# Altium schematic sheet 4_CPU.SchDoc
size A3
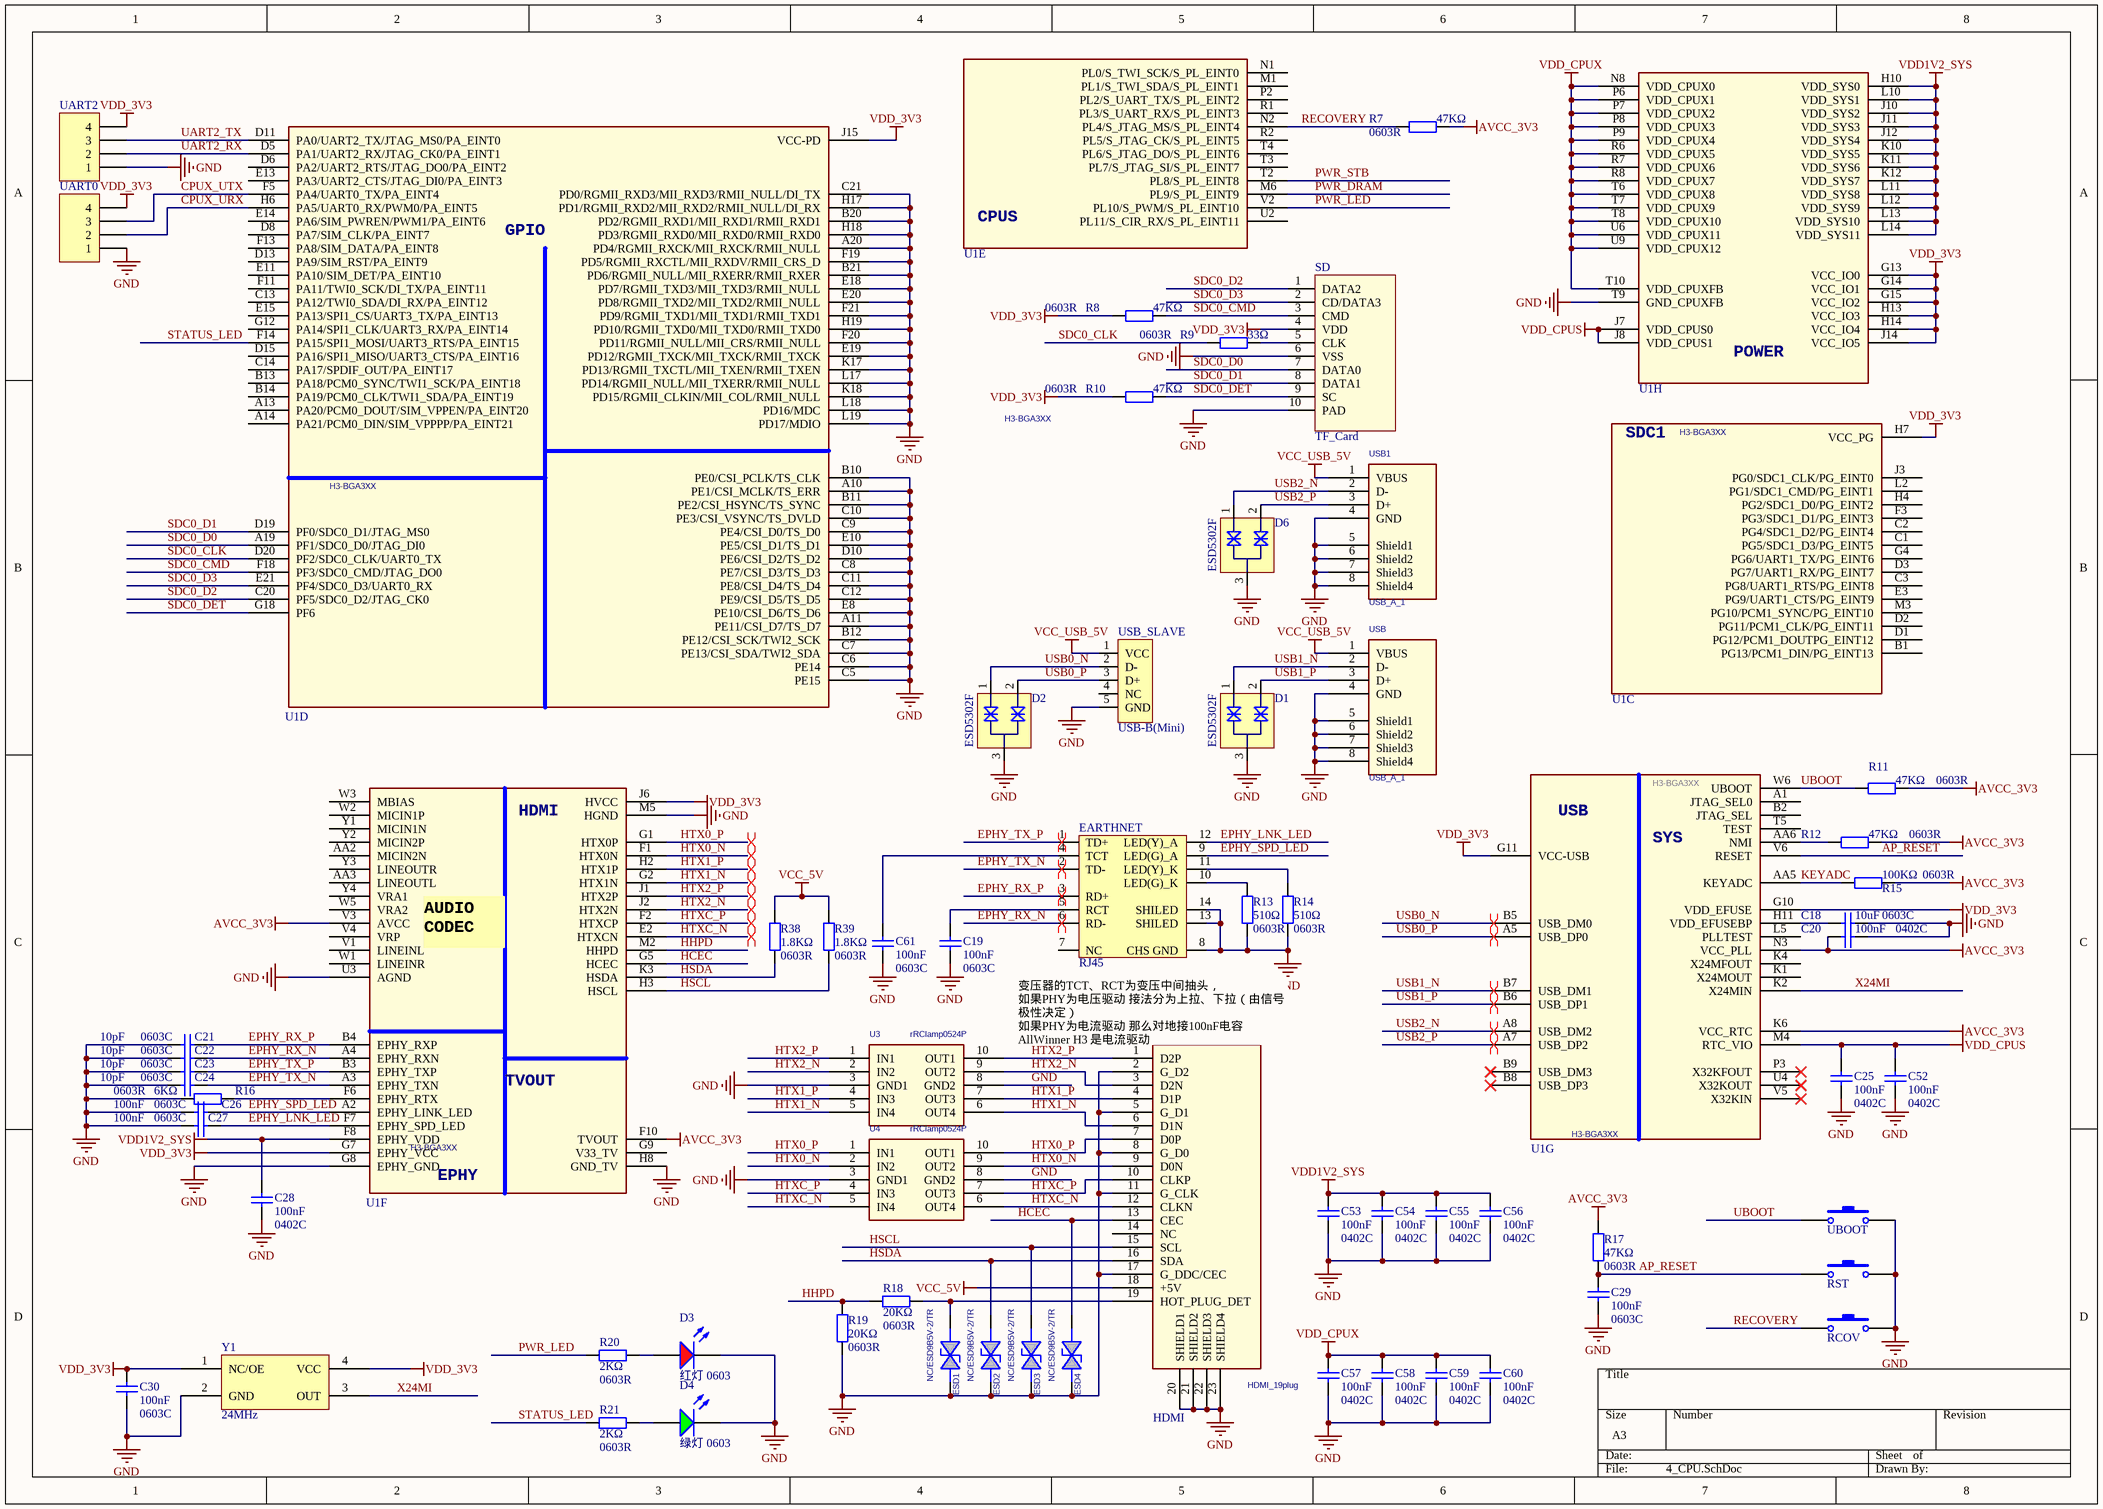
[diagram p0: 4_CPU.SchDoc]

## Parts
C18  10uF  Package: 0603C  [0603_C]
C19  100nF  Package: 0603C  [0603_C]
C20  100nF  Package: 0402C  [0402_C]
C21  10pF  Package: 0603C  [0603_C]
C22  10pF  Package: 0603C  [0603_C]
C23  10pF  Package: 0603C  [0603_C]
C24  10pF  Package: 0603C  [0603_C]
C25  100nF  Package: 0402C  [0402_C]
C26  100nF  Package: 0603C  [0603_C]
C27  100nF  Package: 0603C  [0603_C]
C28  100nF  Package: 0402C  [0402_C]
C29  100nF  Package: 0603C  [0603_C]
C30  100nF  Package: 0603C  [0603_C]
C52  100nF  Package: 0402C  [0402_C]
C53  100nF  Package: 0402C  [0402_C]
C54  100nF  Package: 0402C  [0402_C]
C55  100nF  Package: 0402C  [0402_C]
C56  100nF  Package: 0402C  [0402_C]
C57  100nF  Package: 0402C  [0402_C]
C58  100nF  Package: 0402C  [0402_C]
C59  100nF  Package: 0402C  [0402_C]
C60  100nF  Package: 0402C  [0402_C]
C61  100nF  Package: 0603C  [0603_C]
D1  ESD5302F  [SOT23-3]
D2  ESD5302F  [SOT23-3]
D3  红灯 0603  [0603_LED_S1]
D4  绿灯 0603  [0603_LED_S1]
D6  ESD5302F  [SOT23-3]
EARTHNET  RJ45  [HR911105A]
ESD1  NC/ESD9B5V-2/TR  [tvs0402]
ESD2  NC/ESD9B5V-2/TR  [tvs0402]
ESD3  NC/ESD9B5V-2/TR  [tvs0402]
ESD4  NC/ESD9B5V-2/TR  [tvs0402]
HDMI  HDMI_19plug  [HDMI_SMD_A]
R7  47KΩ  Package: 0603R  [0603_R]
R8  47KΩ  Package: 0603R  [0603_R]
R9  33Ω  Package: 0603R  [0603_R]
R10  47KΩ  Package: 0603R  [0603_R]
R11  47KΩ  Package: 0603R  [0603_R]
R12  47KΩ  Package: 0603R  [0603_R]
R13  510Ω  Package: 0603R  [0603_R]
R14  510Ω  Package: 0603R  [0603_R]
R15  100KΩ  Package: 0603R  [0603_R]
R16  6KΩ  Package: 0603R  [0603_R]
R17  47KΩ  Package: 0603R  [0603_R]
R18  20KΩ  Package: 0603R  [0603_R]
R19  20KΩ  Package: 0603R  [0603_R]
R20  2KΩ  Package: 0603R  [0603_R]
R21  2KΩ  Package: 0603R  [0603_R]
R38  1.8KΩ  Package: 0603R  [0603_R]
R39  1.8KΩ  Package: 0603R  [0603_R]
RCOV  SW-PB  [SW_PB2_A1]  (value not drawn)
RST  SW-PB  [SW_PB2_A1]  (value not drawn)
SD  TF_Card  [SD_MINI]
U1  H3-BGA3XX  [BGA347P0_65B14X14]  (parts C,D,E,F,G,H of 9)
U3  rRClamp0524P  [RCLAMP0524P]
U4  rRClamp0524P  [RCLAMP0524P]
UART0  SWD  [HDR1X4]  (value not drawn)
UART2  SWD  [HDR1X4]  (value not drawn)
UBOOT  SW-PB  [SW_PB2_A1]  (value not drawn)
USB  USB_A_1  [USB_A_1]
USB1  USB_A_1  [USB_A_1]
USB_SLAVE  USB-B(Mini)  [USB/SM0.8-6H5]
Y1  24MHz  [SMDXTAL3225]

## Nets
AVCC_3V3: C20.2 R7.1 R11.1 R12.1 R15.1 R17.1 U1.F10(TVOUT) U1.K6(VCC_RTC) U1.N3(VCC_PLL) U1.V3(AVCC)
GND: C18.2 C19.1 C20.1 C21.2 C22.2 C23.2 C24.2 C25.1 C26.2 C27.2 C28.1 C29.1 C30.1 C52.1 C53.1 C54.1 C55.1 C56.1 C57.1 C58.1 C59.1 C60.1 C61.1 D1.3 D2.3 D3.K D4.K D6.3 EARTHNET.8(CHS_GND) EARTHNET.13(SHILED) EARTHNET.14(SHILED) ESD1.2(CATHODE) ESD2.2(CATHODE) ESD3.2(CATHODE) ESD4.2(CATHODE) HDMI.2(G_D2) HDMI.5(G_D1) HDMI.8(G_D0) HDMI.11(G_CLK) HDMI.17(G_DDC/CEC) HDMI.20(SHIELD1) HDMI.21(SHIELD2) HDMI.22(SHIELD3) HDMI.23(SHIELD4) R13.2 R14.2 R16.2 R19.1 RCOV.2 RST.2 SD.6(VSS) SD.10(PAD) U1.A10(PE1/CSI_MCLK/TS_ERR) U1.A11(PE11/CSI_D7/TS_D7) U1.A20(PD4/RGMII_RXCK/MII_RXCK/RMII_NULL) U1.B10(PE0/CSI_PCLK/TS_CLK) U1.B11(PE2/CSI_HSYNC/TS_SYNC) U1.B12(PE12/CSI_SCK/TWI2_SCK) U1.B20(PD2/RGMII_RXD1/MII_RXD1/RMII_RXD1) U1.B21(PD6/RGMII_NULL/MII_RXERR/RMII_RXER) U1.C5(PE15) U1.C6(PE14) U1.C7(PE13/CSI_SDA/TWI2_SDA) U1.C8(PE7/CSI_D3/TS_D3) U1.C9(PE4/CSI_D0/TS_D0) U1.C10(PE3/CSI_VSYNC/TS_DVLD) U1.C11(PE8/CSI_D4/TS_D4) U1.C12(PE9/CSI_D5/TS_D5) U1.C21(PD0/RGMII_RXD3/MII_RXD3/RMII_NULL/DI_TX) U1.D10(PE6/CSI_D2/TS_D2) U1.E8(PE10/CSI_D6/TS_D6) U1.E10(PE5/CSI_D1/TS_D1) U1.E18(PD7/RGMII_TXD3/MII_TXD3/RMII_NULL) U1.E19(PD12/RGMII_TXCK/MII_TXCK/RMII_TXCK) U1.E20(PD8/RGMII_TXD2/MII_TXD2/RMII_NULL) U1.F19(PD5/RGMII_RXCTL/MII_RXDV/RMII_CRS_D) U1.F20(PD11/RGMII_NULL/MII_CRS/RMII_NULL) U1.F21(PD9/RGMII_TXD1/MII_TXD1/RMII_TXD1) U1.G8(EPHY_GND) U1.H8(GND_TV) U1.H17(PD1/RGMII_RXD2/MII_RXD2/RMII_NULL/DI_RX) U1.H18(PD3/RGMII_RXD0/MII_RXD0/RMII_RXD0) U1.H19(PD10/RGMII_TXD0/MII_TXD0/RMII_TXD0) U1.K17(PD13/RGMII_TXCTL/MII_TXEN/RMII_TXEN) U1.K18(PD15/RGMII_CLKIN/MII_COL/RMII_NULL) U1.L17(PD14/RGMII_NULL/MII_TXERR/RMII_NULL) U1.L18(PD16/MDC) U1.L19(PD17/MDIO) U1.M5(HGND) U1.T9(GND_CPUXFB) U1.U3(AGND) U3.3(GND1) U3.8(GND2) U4.3(GND1) U4.8(GND2) UART0.1 UART2.1 UBOOT.2 USB.4(GND) USB.5(Shield1) USB.6(Shield2) USB.7(Shield3) USB.8(Shield4) USB1.4(GND) USB1.5(Shield1) USB1.6(Shield2) USB1.7(Shield3) USB1.8(Shield4) USB_SLAVE.5(GND) Y1.2(GND)
VCC_5V: HDMI.18(+5V) R38.1 R39.1
VCC_USB_5V: USB.1(VBUS) USB1.1(VBUS) USB_SLAVE.1(VCC)
VDD1V2_SYS: C28.2 C53.2 C54.2 C55.2 C56.2 U1.F8(EPHY_VDD) U1.H10(VDD_SYS0) U1.J10(VDD_SYS2) U1.J11(VDD_SYS3) U1.J12(VDD_SYS4) U1.K10(VDD_SYS5) U1.K11(VDD_SYS6) U1.K12(VDD_SYS7) U1.L10(VDD_SYS1) U1.L11(VDD_SYS8) U1.L12(VDD_SYS9) U1.L13(VDD_SYS10) U1.L14(VDD_SYS11)
VDD_3V3: C30.2 R8.2 R10.2 SD.4(VDD) U1.G7(EPHY_VCC) U1.G10(VDD_EFUSE) U1.G11(VCC-USB) U1.G13(VCC_IO0) U1.G14(VCC_IO1) U1.G15(VCC_IO2) U1.H7(VCC_PG) U1.H13(VCC_IO3) U1.H14(VCC_IO4) U1.J6(HVCC) U1.J14(VCC_IO5) U1.J15(VCC-PD) UART0.4 UART2.4 Y1.1(NC/OE) Y1.4(VCC)
VDD_CPUS: C25.2 C52.2 U1.J7(VDD_CPUS0) U1.J8(VDD_CPUS1) U1.M4(RTC_VIO)
VDD_CPUX: C57.2 C58.2 C59.2 C60.2 U1.N8(VDD_CPUX0) U1.P6(VDD_CPUX1) U1.P7(VDD_CPUX2) U1.P8(VDD_CPUX3) U1.P9(VDD_CPUX4) U1.R6(VDD_CPUX5) U1.R7(VDD_CPUX6) U1.R8(VDD_CPUX7) U1.T6(VDD_CPUX8) U1.T7(VDD_CPUX9) U1.T8(VDD_CPUX10) U1.T10(VDD_CPUXFB) U1.U6(VDD_CPUX11) U1.U9(VDD_CPUX12)
AP_RESET: C29.2 R17.2 RST.1 U1.V6(RESET)
CPUX_URX: U1.H6(PA5/UART0_RX/PWM0/PA_EINT5) UART0.2
CPUX_UTX: U1.F5(PA4/UART0_TX/PA_EINT4) UART0.3
EPHY_LNK_LED: C27.1 EARTHNET.12(LED(Y)_A) U1.F7(EPHY_SPD_LED)
EPHY_RX_N: C22.1 EARTHNET.6(RD-) U1.A4(EPHY_RXN)
EPHY_RX_P: C21.1 EARTHNET.3(RD+) U1.B4(EPHY_RXP)
EPHY_SPD_LED: C26.1 EARTHNET.9(LED(G)_A) U1.A2(EPHY_LINK_LED)
EPHY_TX_N: C24.1 EARTHNET.2(TD-) U1.A3(EPHY_TXN)
EPHY_TX_P: C23.1 EARTHNET.1(TD+) U1.B3(EPHY_TXP)
HCEC: ESD4.1(ANODE) HDMI.13(CEC) U1.G5(HCEC)
HHPD: R18.1 R19.2 U1.M2(HHPD)
HSCL: ESD3.1(ANODE) HDMI.15(SCL) R39.2 U1.H3(HSCL)
HSDA: ESD2.1(ANODE) HDMI.16(SDA) R38.2 U1.K3(HSDA)
HTX0_N: HDMI.9(D0N) U1.F1(HTX0N) U4.2(IN2) U4.9(OUT2)
HTX0_P: HDMI.7(D0P) U1.G1(HTX0P) U4.1(IN1) U4.10(OUT1)
HTX1_N: HDMI.6(D1N) U1.G2(HTX1N) U3.5(IN4) U3.6(OUT4)
HTX1_P: HDMI.4(D1P) U1.H2(HTX1P) U3.4(IN3) U3.7(OUT3)
HTX2_N: HDMI.3(D2N) U1.J2(HTX2N) U3.2(IN2) U3.9(OUT2)
HTX2_P: HDMI.1(D2P) U1.J1(HTX2P) U3.1(IN1) U3.10(OUT1)
HTXC_N: HDMI.12(CLKN) U1.E2(HTXCN) U4.5(IN4) U4.6(OUT4)
HTXC_P: HDMI.10(CLKP) U1.F2(HTXCP) U4.4(IN3) U4.7(OUT3)
KEYADC: R15.2 U1.AA5(KEYADC)
PWR_DRAM: U1.M6(PL9/S_PL_EINT9)
PWR_LED: R20.1 U1.V2(PL10/S_PWM/S_PL_EINT10)
PWR_STB: U1.T2(PL8/S_PL_EINT8)
RECOVERY: R7.2 RCOV.1 U1.N2(PL4/S_JTAG_MS/S_PL_EINT4)
SDC0_CLK: R9.2 U1.D20(PF2/SDC0_CLK/UART0_TX)
SDC0_CMD: R8.1 SD.3(CMD) U1.F18(PF3/SDC0_CMD/JTAG_DO0)
SDC0_D0: SD.7(DATA0) U1.A19(PF1/SDC0_D0/JTAG_DI0)
SDC0_D1: SD.8(DATA1) U1.D19(PF0/SDC0_D1/JTAG_MS0)
SDC0_D2: SD.1(DATA2) U1.C20(PF5/SDC0_D2/JTAG_CK0)
SDC0_D3: SD.2(CD/DATA3) U1.E21(PF4/SDC0_D3/UART0_RX)
SDC0_DET: R10.1 SD.9(SC) U1.G18(PF6)
STATUS_LED: R21.1 U1.F14(PA15/SPI1_MOSI/UART3_RTS/PA_EINT15)
UART2_RX: U1.D5(PA1/UART2_RX/JTAG_CK0/PA_EINT1) UART2.2
UART2_TX: U1.D11(PA0/UART2_TX/JTAG_MS0/PA_EINT0) UART2.3
UBOOT: R11.2 U1.W6(UBOOT) UBOOT.1
USB0_N: D2.1 U1.B5(USB_DM0) USB_SLAVE.2(D-)
USB0_P: D2.2 U1.A5(USB_DP0) USB_SLAVE.3(D+)
USB1_N: D1.1 U1.B7(USB_DM1) USB.2(D-)
USB1_P: D1.2 U1.B6(USB_DP1) USB.3(D+)
USB2_N: D6.1 U1.A8(USB_DM2) USB1.2(D-)
USB2_P: D6.2 U1.A7(USB_DP2) USB1.3(D+)
X24MI: U1.K2(X24MIN) Y1.3(OUT)
NetC18_1: C18.1 U1.H11(VDD_EFUSEBP)
NetC19_2: C19.2 EARTHNET.5(RCT)
NetC61_2: C61.2 EARTHNET.4(TCT)
NetD3_A: D3.A R20.2
NetD4_A: D4.A R21.2
NetEARTHNET_10: EARTHNET.10(LED(G)_K) R13.1
NetEARTHNET_11: EARTHNET.11(LED(Y)_K) R14.1
NetESD1_1: ESD1.1(ANODE) HDMI.19(HOT_PLUG_DET) R18.2
NetR9_1: R9.1 SD.5(CLK)
NetR12_2: R12.2 U1.AA6(NMI)
NetR16_1: R16.1 U1.F6(EPHY_RTX)

Not connected (* = marked no-connect by the designer): EARTHNET 7(NC); HDMI 14(NC); U1 A1(JTAG_SEL0) A13(PA20/PCM0_DOUT/SIM_VPPEN/PA_EINT20) A14(PA21/PCM0_DIN/SIM_VPPPP/PA_EINT21) AA2(MICIN2N) AA3(LINEOUTL) B1(PG13/PCM1_DIN/PG_EINT13) B2(JTAG_SEL) B8(USB_DP3)* B9(USB_DM3)* B13(PA18/PCM0_SYNC/TWI1_SCK/PA_EINT18) B14(PA19/PCM0_CLK/TWI1_SDA/PA_EINT19) C1(PG5/SDC1_D3/PG_EINT5) C2(PG4/SDC1_D2/PG_EINT4) C3(PG8/UART1_RTS/PG_EINT8) C13(PA12/TWI0_SDA/DI_RX/PA_EINT12) C14(PA17/SPDIF_OUT/PA_EINT17) D1(PG12/PCM1_DOUTPG_EINT12) D2(PG11/PCM1_CLK/PG_EINT11) D3(PG7/UART1_RX/PG_EINT7) D6(PA2/UART2_RTS/JTAG_DO0/PA_EINT2) D8(PA7/SIM_CLK/PA_EINT7) D13(PA9/SIM_RST/PA_EINT9) D15(PA16/SPI1_MISO/UART3_CTS/PA_EINT16) E3(PG9/UART1_CTS/PG_EINT9) E11(PA10/SIM_DET/PA_EINT10) E13(PA3/UART2_CTS/JTAG_DI0/PA_EINT3) E14(PA6/SIM_PWREN/PWM1/PA_EINT6) E15(PA13/SPI1_CS/UART3_TX/PA_EINT13) F3(PG3/SDC1_D1/PG_EINT3) F11(PA11/TWI0_SCK/DI_TX/PA_EINT11) F13(PA8/SIM_DATA/PA_EINT8) G4(PG6/UART1_TX/PG_EINT6) G9(V33_TV) G12(PA14/SPI1_CLK/UART3_RX/PA_EINT14) H4(PG2/SDC1_D0/PG_EINT2) J3(PG0/SDC1_CLK/PG_EINT0) K1(X24MOUT) K4(X24MFOUT) L2(PG1/SDC1_CMD/PG_EINT1) L5(PLLTEST) M1(PL1/S_TWI_SDA/S_PL_EINT1) M3(PG10/PCM1_SYNC/PG_EINT10) N1(PL0/S_TWI_SCK/S_PL_EINT0) P2(PL2/S_UART_TX/S_PL_EINT2) P3(X32KFOUT)* R1(PL3/S_UART_RX/S_PL_EINT3) R2(PL5/S_JTAG_CK/S_PL_EINT5) T3(PL7/S_JTAG_SI/S_PL_EINT7) T4(PL6/S_JTAG_DO/S_PL_EINT6) T5(TEST) U2(PL11/S_CIR_RX/S_PL_EINT11) U4(X32KOUT)* V1(LINEINL) V4(VRP) V5(X32KIN)* W1(LINEINR) W2(MICIN1P) W3(MBIAS) W5(VRA2) Y1(MICIN1N) Y2(MICIN2P) Y3(LINEOUTR) Y4(VRA1); USB_SLAVE 4(NC)

## Layout directives
differential pair: EPHY_RX_N, EPHY_RX_P, EPHY_TX_N, EPHY_TX_P, HTX0_N, HTX0_P, HTX1_N, HTX1_P, HTX2_N, HTX2_P, HTXC_N, HTXC_P, USB0_N, USB0_P, USB1_N, USB1_P, USB2_N, USB2_P

## Notes on the sheet
- (near HDMI) 变压器的TCT、RCT为变压中间抽头，
  如果PHY为电压驱动 接法分为上拉、下拉（由信号极性决定）
  如果PHY为电流驱动 那么对地接100nF电容
  AllWinner H3 是电流驱动
- (in symbol H3-BGA3XX, part C) SDC1
- (in symbol H3-BGA3XX, part D) GPIO
- (in symbol H3-BGA3XX, part E) CPUS
- (in symbol H3-BGA3XX, part F) HDMI; AUDIO / CODEC; EPHY
- (in symbol H3-BGA3XX, part G) USB; SYS
- (in symbol H3-BGA3XX, part H) POWER

## Library data of the parts
C18 = 0603 2.7pF (2R7) 0.25pF 50V: 贴片电容; ComponentLink1Description: 供应商链接; ComponentLink1URL: http://www.szlcsc.com/product/details_16831.html; Supplier: LC; SuppliersPartNumber: C16149
C19-C30 C52-C61 = 0402 1nF (102) 10% 50V: 贴片电容; ComponentLink1Description: 供应商链接; ComponentLink1URL: http://www.szlcsc.com/product/details_1875.html; Supplier: LC; SuppliersPartNumber: C1523
D3 = 0603 红灯: 发光二极管; ComponentLink1Description: 供应商链接; ComponentLink1URL: http://www.szlcsc.com/product/details_2659.html; Package: 0603; Supplier: LC; SuppliersPartNumber: C2286
D4 = 0603 绿灯: 发光二极管; ComponentLink1Description: 供应商链接; ComponentLink1URL: http://www.szlcsc.com/product/details_73152.html; Package: 0603; Supplier: LC; SuppliersPartNumber: C72043
EARTHNET = HR911105
ESD1-ESD4 = 1_1.5KE100A: 1ST PART DESCRIPTION: WILL ESD9B5V Bidirection ESD Protection
HDMI = HDMI19_PLUG
R7-R21 R38 R39 = 0402 1KΩ (1001) 1%: 贴片电阻; ComponentLink1Description: 供应商链接; ComponentLink1URL: http://www.szlcsc.com/product/details_12256.html; Supplier: LC; SuppliersPartNumber: C11702
RCOV RST UBOOT = SW-PB: 微动开关; Published: 24-Mar-1999; LatestRevisionDate: 17-Jul-2002; LatestRevisionNote: Re-released for DXP Platform.; PackageReference: SPST-2; Publisher: Altium Limited
SD = TF_Card: TF卡座; 版权归属: 源创客; BOM名称: TF卡座; 学习资源: www.ooocke.com
UART0 UART2 = Header 4: Header, 4-Pin; LatestRevisionDate: 17-Jul-2002; LatestRevisionNote: Re-released for DXP Platform.; Publisher: Altium Limited
USB_SLAVE = USB5
Y1 = XTAL4_OSCILLATOR: 有源晶振; value: 7.3728M